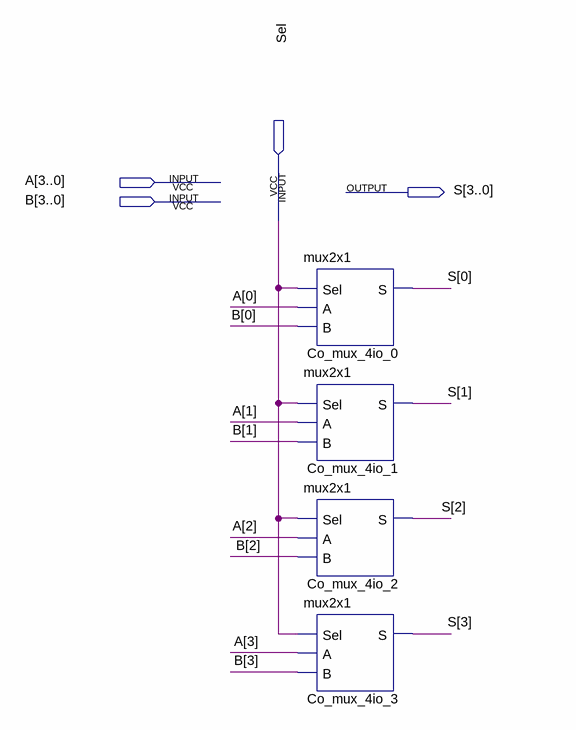
[diagram p0: schematic sheet]
// Quartus schematic mux2x1_4io.bdf as structural Verilog: 4 symbols, 4 pins
module mux2x1_4io (
  input  [3:0] A,
  input  [3:0] B,
  input  Sel,
  output [3:0] S
);

  mux2x1 Co_mux_4io_0 (.Sel(Sel), .A(A[0]), .B(B[0]), .S(S[0]));
  mux2x1 Co_mux_4io_1 (.Sel(Sel), .A(A[1]), .B(B[1]), .S(S[1]));
  mux2x1 Co_mux_4io_2 (.Sel(Sel), .A(A[2]), .B(B[2]), .S(S[2]));
  mux2x1 Co_mux_4io_3 (.Sel(Sel), .A(A[3]), .B(B[3]), .S(S[3]));
endmodule
